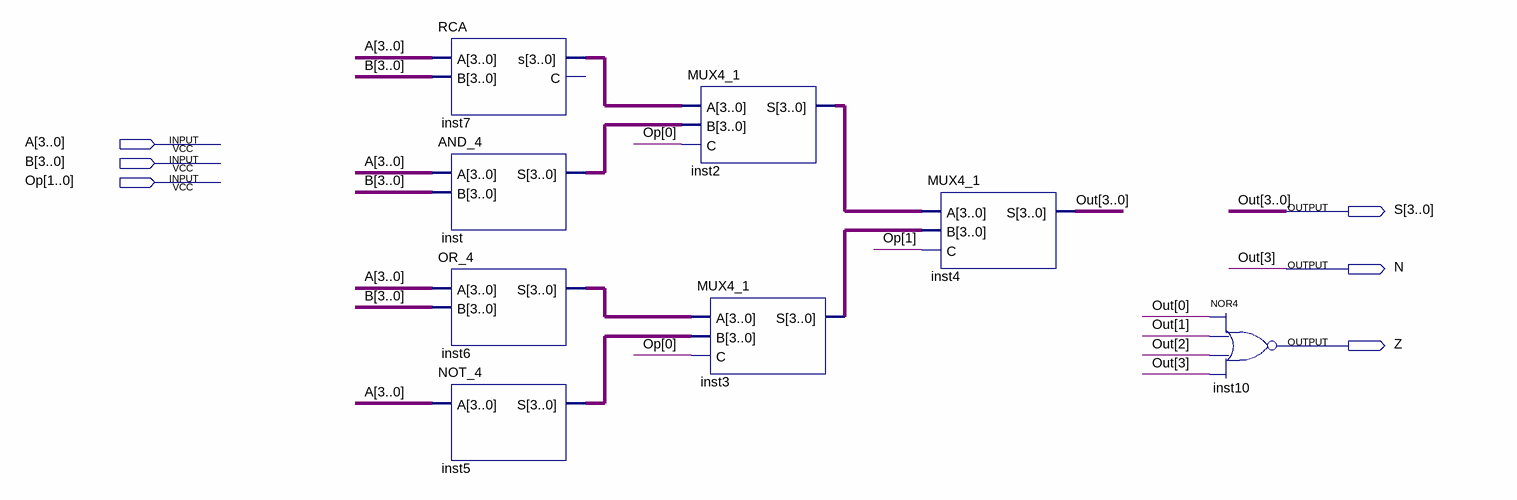
[diagram p0: schematic sheet]
// Quartus schematic ULA.bdf as structural Verilog: 8 symbols, 6 pins
module ULA (
  input  [3:0] A,
  input  [3:0] B,
  input  [1:0] Op,
  output [3:0] S,
  output N,
  output Z
);

  wire [3:0] inst2_s, inst3_s, inst5_s, inst6_s, inst7_s, inst_s;

  RCA inst7 (.A(A), .B(B), .s(inst7_s));  // open: C
  AND_4 inst (.A(A), .B(B), .S(inst_s));
  OR_4 inst6 (.A(A), .B(B), .S(inst6_s));
  NOT_4 inst5 (.A(A), .S(inst5_s));
  MUX4_1 inst2 (.A(inst7_s), .B(inst_s), .C(Op[0]), .S(inst2_s));
  MUX4_1 inst3 (.A(inst6_s), .B(inst5_s), .C(Op[0]), .S(inst3_s));
  MUX4_1 inst4 (.A(inst2_s), .B(inst3_s), .C(Op[1]), .S({N, S[2:0]}));
  nor inst10 (Z, S[0], S[1], S[2], N);

  assign S[3] = N;

  // Other names for the same wires on the sheet: Out[3:0] = {N, S[2:0]}
endmodule
